# Altium project SVPXGR740_3U.PrjPcb (part 1 of 8)
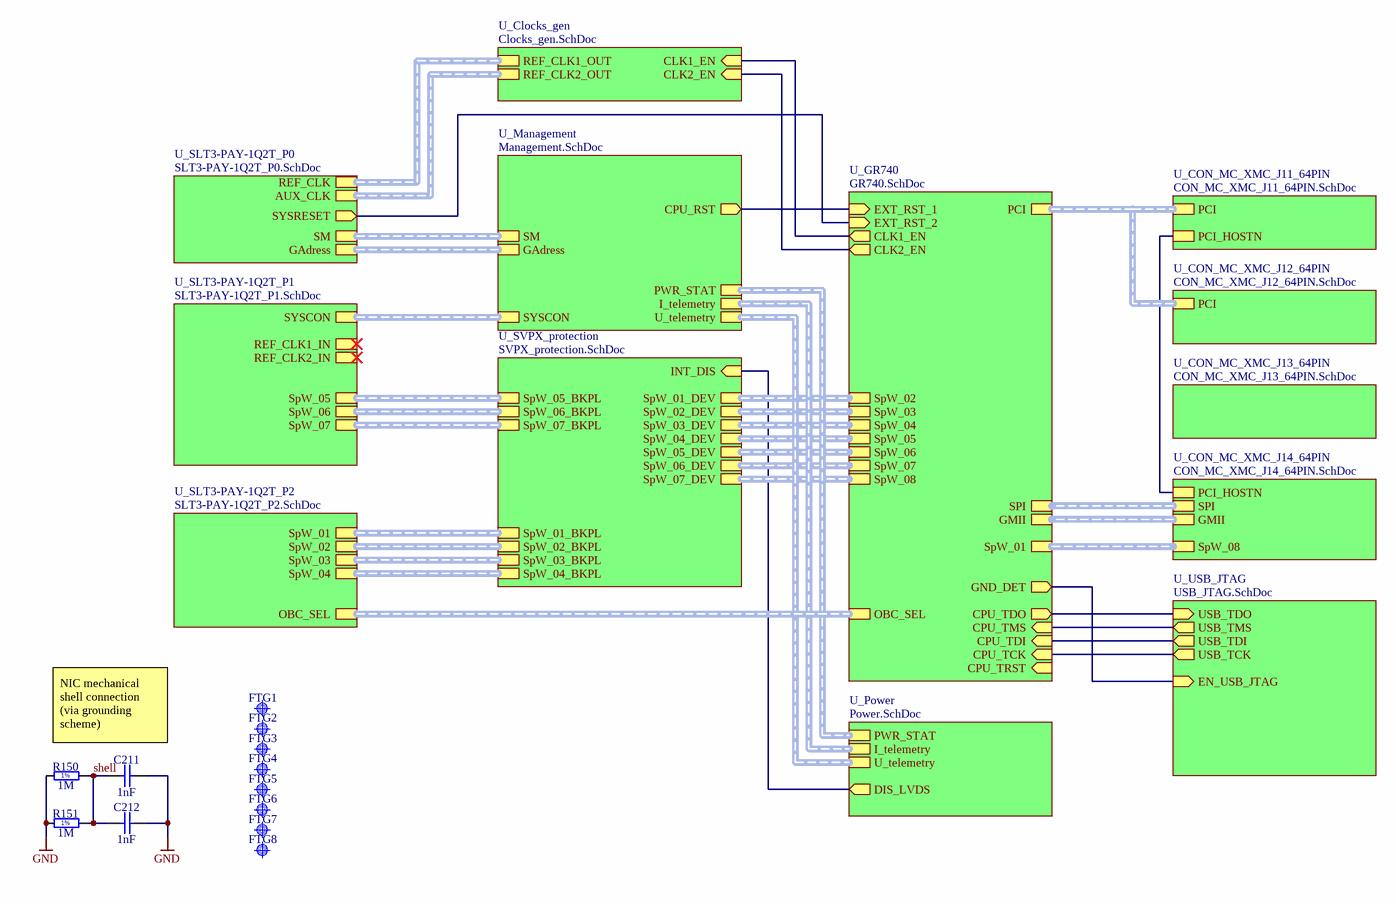
[diagram p0: SVPXGR740_3U.SchDoc]
ProjectAddress1: IBP Shanghai; ProjectAddress2: Level 3 - Building 3; ProjectAddress3: No.168 Linhong Road; ProjectAddress4: Shanghai 200335, China; ProjectOrganization: Altium; ProjectTitle: VPX 6U; Template Family: VPX; Template Notes: - Nominal values used, all dimensions are mm.  - Stackup is not specified in AV46DOT0.PDF, nor implemented in this template.  - The component height constraint is defined in AV46DOT0.pdf, page 90.; Template Revision Date: May 2011; Template Source Document: AV46DOT0.pdf; Template Source Name: ANSI/VITA 46.0-2007; Template Source Organization: VITA; Template Source Revision Date: Oct-2007; Template Source URL: www.vita.com
24 sheets, 790 parts. Net scope: hierarchical (ports join the sheet entries above them; power ports are global).
Board file: SVPXGR740_3U.PcbDoc
Sheets:
  SVPXGR740_3U.SchDoc
    U_SLT3-PAY-1Q2T_P0 = SLT3-PAY-1Q2T_P0.SchDoc
    U_SLT3-PAY-1Q2T_P1 = SLT3-PAY-1Q2T_P1.SchDoc
    U_SLT3-PAY-1Q2T_P2 = SLT3-PAY-1Q2T_P2.SchDoc
    U_SVPX_protection = SVPX_protection.SchDoc
      SpW_01_prot = SpW_protection.SchDoc
      SpW_02_prot = SpW_protection.SchDoc
      SpW_03_prot = SpW_protection.SchDoc
      SpW_04_prot = SpW_protection.SchDoc
      SpW_05_prot = SpW_protection.SchDoc
      SpW_06_prot = SpW_protection.SchDoc
      SpW_07_prot = SpW_protection.SchDoc
    U_GR740 = GR740.SchDoc
      U_GR740_GPIO = GR740_GPIO.SchDoc
      U_GR740_Memory = GR740_Memory.SchDoc
      U_GR740_Power = GR740_Power.SchDoc
      U_GR740_SpW = GR740_SpW.SchDoc
      U_SDRAM = SDRAM.SchDoc
      U_Clocks = Clocks.SchDoc
      U_Flash = Flash.SchDoc
    U_CON_MC_XMC_J11_64PIN = CON_MC_XMC_J11_64PIN.SchDoc
    U_CON_MC_XMC_J12_64PIN = CON_MC_XMC_J12_64PIN.SchDoc
    U_CON_MC_XMC_J13_64PIN = CON_MC_XMC_J13_64PIN.SchDoc
    U_CON_MC_XMC_J14_64PIN = CON_MC_XMC_J14_64PIN.SchDoc
    U_Power = Power.SchDoc
      U_PWR_3V3 = PWR_3V3.SchDoc
    U_USB_JTAG = USB_JTAG.SchDoc
    U_Management = Management.SchDoc
      U_NIC_MSP430_power_jtag = MSP430_power_jtag.SchDoc
    U_Clocks_gen = Clocks_gen.SchDoc

## Sheet SVPXGR740_3U.SchDoc: SVPXFMC Carrier 3U
size 420 x 297 mm; CheckedBy: \; Author: G.Kasprowicz; CompanyName: ISE; DrawnBy: T.Przywozki; Organization: WUT ISE; Address1: Warsaw University of Technology; Address2: Nowowiejska 15/19 00-665 Warsaw; Revision: 1.0.; SheetNumber: 1; SheetTotal: 20; ModifiedBy: -; CheckedDate: -; Title2: Top; DivGrp: ISE; Designer: G.Kasprowicz; Project: SVPXFMC Carrier 3U; ModifiedDate: -; ProjectName: FMC SFP 4

### Parts
C211  1nF  [CAPC1005X55N]
C212  1nF  [CAPC1005X55N]
FTG1  Use only in PCB  [FIDUCIAL_TOP_C100-200]  (value not drawn)
FTG2  Use only in PCB  [FIDUCIAL_TOP_C100-200]  (value not drawn)
FTG3  Use only in PCB  [FIDUCIAL_TOP_C100-200]  (value not drawn)
FTG4  Use only in PCB  [FIDUCIAL_TOP_C100-200]  (value not drawn)
FTG5  Use only in PCB  [FIDUCIAL_TOP_C100-200]  (value not drawn)
FTG6  Use only in PCB  [FIDUCIAL_TOP_C100-200]  (value not drawn)
FTG7  Use only in PCB  [FIDUCIAL_TOP_C100-200]  (value not drawn)
FTG8  Use only in PCB  [FIDUCIAL_TOP_C100-200]  (value not drawn)
R150  1M  [RESC1005X40N]
R151  1M  [RESC1005X40N]

### Sub-sheets
U_Clocks_gen = Clocks_gen.SchDoc: REF_CLK1_OUT (harness CLK), REF_CLK2_OUT (harness CLK), CLK1_EN (in), CLK2_EN (in)
U_CON_MC_XMC_J11_64PIN = CON_MC_XMC_J11_64PIN.SchDoc: PCI (harness PCI), PCI_HOSTN
U_CON_MC_XMC_J12_64PIN = CON_MC_XMC_J12_64PIN.SchDoc: PCI (harness PCI)
U_CON_MC_XMC_J13_64PIN = CON_MC_XMC_J13_64PIN.SchDoc: no entries
U_CON_MC_XMC_J14_64PIN = CON_MC_XMC_J14_64PIN.SchDoc: PCI_HOSTN, SPI (harness SPI), GMII (harness GMII), SpW_08 (harness SpW)
U_GR740 = GR740.SchDoc: EXT_RST_1 (in), PCI (harness PCI), SPI (harness SPI), GMII (harness GMII), SpW_06 (harness SpW), SpW_05 (harness SpW), SpW_04 (harness SpW), SpW_03 (harness SpW), SpW_01 (harness SpW), SpW_07 (harness SpW), SpW_08 (harness SpW), SpW_02 (harness SpW), CPU_TDO (out), CPU_TMS (in), CPU_TDI (in), CPU_TCK (in), CPU_TRST (in), OBC_SEL (harness OBC_SEL), EXT_RST_2 (in), CLK1_EN (out), CLK2_EN (out), GND_DET (out)
U_Management = Management.SchDoc: SM (harness SM), GAdress (harness GAdress), U_telemetry (harness Umeas), I_telemetry (harness Imeas), PWR_STAT (harness PWR_STAT), SYSCON (harness SYSCON), CPU_RST (out)
U_Power = Power.SchDoc: I_telemetry (harness Imeas), U_telemetry (harness Umeas), PWR_STAT (harness PWR_STAT), DIS_LVDS (out)
U_SLT3-PAY-1Q2T_P0 = SLT3-PAY-1Q2T_P0.SchDoc: AUX_CLK (harness CLK), REF_CLK (harness CLK), GAdress (harness GAdress), SM (harness SM), SYSRESET (out)
U_SLT3-PAY-1Q2T_P1 = SLT3-PAY-1Q2T_P1.SchDoc: SYSCON (harness SYSCON), REF_CLK2_IN (harness CLK), REF_CLK1_IN (harness CLK), SpW_05 (harness SpW), SpW_06 (harness SpW), SpW_07 (harness SpW)
U_SLT3-PAY-1Q2T_P2 = SLT3-PAY-1Q2T_P2.SchDoc: SpW_02 (harness SpW), OBC_SEL (harness OBC_SEL), SpW_04 (harness SpW), SpW_03 (harness SpW), SpW_01 (harness SpW)
U_SVPX_protection = SVPX_protection.SchDoc: INT_DIS (in), SpW_01_BKPL (harness SpW), SpW_01_DEV (harness SpW), SpW_02_BKPL (harness SpW), SpW_03_BKPL (harness SpW), SpW_04_BKPL (harness SpW), SpW_05_BKPL (harness SpW), SpW_02_DEV (harness SpW), SpW_05_DEV (harness SpW), SpW_06_BKPL (harness SpW), SpW_07_BKPL (harness SpW), SpW_06_DEV (harness SpW), SpW_07_DEV (harness SpW), SpW_03_DEV (harness SpW), SpW_04_DEV (harness SpW)
U_USB_JTAG = USB_JTAG.SchDoc: USB_TDO (in), USB_TMS (out), USB_TDI (out), USB_TCK (out), EN_USB_JTAG (in)

### Nets
GND: C211.2 C212.2 R150.1 R151.1
CLK1_EN: sheet U_GR740/CLK1_EN, sheet U_Clocks_gen/CLK1_EN
CLK2_EN: sheet U_GR740/CLK2_EN, sheet U_Clocks_gen/CLK2_EN
CPU_RST: sheet U_GR740/EXT_RST_1, sheet U_Management/CPU_RST
CPU_TCK: sheet U_GR740/CPU_TCK, sheet U_USB_JTAG/USB_TCK
CPU_TDI: sheet U_GR740/CPU_TDI, sheet U_USB_JTAG/USB_TDI
CPU_TDO: sheet U_GR740/CPU_TDO, sheet U_USB_JTAG/USB_TDO
CPU_TMS: sheet U_GR740/CPU_TMS, sheet U_USB_JTAG/USB_TMS
DIS_LVDS: sheet U_SVPX_protection/INT_DIS, sheet U_Power/DIS_LVDS
GND_DET: sheet U_GR740/GND_DET, sheet U_USB_JTAG/EN_USB_JTAG
PCI_HOSTN: sheet U_CON_MC_XMC_J11_64PIN/PCI_HOSTN, sheet U_CON_MC_XMC_J14_64PIN/PCI_HOSTN
shell: C211.1 C212.1 R150.2 R151.2  [project net shell_1]
SYSRESET*: sheet U_SLT3-PAY-1Q2T_P0/SYSRESET, sheet U_GR740/EXT_RST_2

### Buses and harness runs
harness sheet U_Clocks_gen/REF_CLK1_OUT = sheet U_SLT3-PAY-1Q2T_P0/REF_CLK
harness sheet U_Clocks_gen/REF_CLK2_OUT = sheet U_SLT3-PAY-1Q2T_P0/AUX_CLK
harness sheet U_CON_MC_XMC_J11_64PIN/PCI = sheet U_CON_MC_XMC_J12_64PIN/PCI = sheet U_GR740/PCI
harness sheet U_CON_MC_XMC_J14_64PIN/GMII = sheet U_GR740/GMII
harness sheet U_CON_MC_XMC_J14_64PIN/SPI = sheet U_GR740/SPI
harness sheet U_CON_MC_XMC_J14_64PIN/SpW_08 = sheet U_GR740/SpW_01
harness sheet U_GR740/OBC_SEL = sheet U_SLT3-PAY-1Q2T_P2/OBC_SEL
harness sheet U_GR740/SpW_02 = sheet U_SVPX_protection/SpW_01_DEV
harness sheet U_GR740/SpW_03 = sheet U_SVPX_protection/SpW_02_DEV
harness sheet U_GR740/SpW_04 = sheet U_SVPX_protection/SpW_03_DEV
harness sheet U_GR740/SpW_05 = sheet U_SVPX_protection/SpW_04_DEV
harness sheet U_GR740/SpW_06 = sheet U_SVPX_protection/SpW_05_DEV
harness sheet U_GR740/SpW_07 = sheet U_SVPX_protection/SpW_06_DEV
harness sheet U_GR740/SpW_08 = sheet U_SVPX_protection/SpW_07_DEV
harness sheet U_Management/GAdress = sheet U_SLT3-PAY-1Q2T_P0/GAdress
harness sheet U_Management/I_telemetry = sheet U_Power/I_telemetry
harness sheet U_Management/PWR_STAT = sheet U_Power/PWR_STAT
harness sheet U_Management/SM = sheet U_SLT3-PAY-1Q2T_P0/SM
harness sheet U_Management/SYSCON = sheet U_SLT3-PAY-1Q2T_P1/SYSCON
harness sheet U_Management/U_telemetry = sheet U_Power/U_telemetry
harness sheet U_SLT3-PAY-1Q2T_P1/SpW_05 = sheet U_SVPX_protection/SpW_05_BKPL
harness sheet U_SLT3-PAY-1Q2T_P1/SpW_06 = sheet U_SVPX_protection/SpW_06_BKPL
harness sheet U_SLT3-PAY-1Q2T_P1/SpW_07 = sheet U_SVPX_protection/SpW_07_BKPL
harness sheet U_SLT3-PAY-1Q2T_P2/SpW_01 = sheet U_SVPX_protection/SpW_01_BKPL
harness sheet U_SLT3-PAY-1Q2T_P2/SpW_02 = sheet U_SVPX_protection/SpW_02_BKPL
harness sheet U_SLT3-PAY-1Q2T_P2/SpW_03 = sheet U_SVPX_protection/SpW_03_BKPL
harness sheet U_SLT3-PAY-1Q2T_P2/SpW_04 = sheet U_SVPX_protection/SpW_04_BKPL

### Notes on the sheet
- NIC mechanical shell connection (via grounding scheme)
- Project/Equipment
- Document
- Designer
- Drawn by
- Check.by
- File
- Last Mod.
- Print Date
- Sheet
- Size
- A3
- of
- Rev
- Copyright WUT ISE 2019
  This documentation describes Open Hardware and is licensed under the CERN OHL v.1.1. You may redistribute and modify this documentation under the terms of the CERN OHL v1.1.
  (http://ohwr.org/CERNOHL). This documentation is dristributed WITHOUT ANY EXPRESS OR IMPLIED WARRANTY, INCLUDING OF MERCHANTABILITY, SATISFACTORY QUALITY AND FITNESS FOR A PARTICULAR PURPOSE. Please see the CERN OHL v.1.1 for applicable conditions
- (in symbol R0402_1M_1%_0.0625W_100PPM) 1%

### Library data of the parts
C211 C212 = CC0402_1NF_50V_10%_X7R: Non-polarised capacitor; Part Description: SMD Multilayer Chip Ceramic Capacitor; Manufacturer: GENERIC; Manufacturer1 Part Number: 223858715623; Voltage: 50V; TC: X7R; Tolerance: ±10%; Part Number: CC0402_1NF_50V_10%_X7R; Component Kind: Standard; Component Type: Standard; Pin Count: 2; Value: 1nF; Status: Not Recommended; Manufacturer Part Number: CC0402_1NF_50V_10%_X7R; Case: 0402; Mounted: Yes; Socket: No; SMD: Yes; Sense: No; Manufacturer1 Example: PHYCOMP; Manufacturer1 ComponentHeight: 0.55mm; HelpURL: \\cern.ch\dfs\Applications\Altium\Datasheets\CC0402_X7R_PHYCOMP.pdf; Author: CERN DEM JLC; CreateDate: 03.12.2007; LatestRevisionDate: 03.12.2007
FTG1-FTG8 = FIDUCIAL_TARGET_C100-200: Fiducial Target; Part Description: Round Fiducial Target, Top Layer, 1.0mm, Top Solder 2.0mm, Keepout =2.0mm; Mounted: No; Part Number: FIDUCIAL_TARGET_C100-200; Component Kind: Standard (No BOM); Component Type: Standard (No BOM); Pin Count: 1; Family: Fiducial; Socket: No; SMD: Yes; Sense: No; Status: None; ComponentHeight: 0mm; HelpURL: Undefined; Author: CERN DEM JLC; CreateDate: 09.02.2010; LatestRevisionDate: 04.04.2012; PackageDescription: Round Fiducial Target, Top Layer, 1.0mm, Top Solder 2.0mm, Keepout =2.0mm
R150 R151 = R0402_1M_1%_0.0625W_100PPM: Resistor - 1%; Part Description: General Purpose Thick Film Chip Resistor; Manufacturer: GENERIC; Manufacturer1 Part Number: 232270671005L; TC: ±100ppm/°C; PressFit: No; Part Number: R0402_1M_1%_0.0625W_100PPM; Component Kind: Standard; Component Type: Standard; Pin Count: 2; Value: 1M; Status: Not Recommended; Power: 0.0625W; Tolerance: ±1%; Manufacturer Part Number: R0402_1M_1%_0.0625W_100PPM; Case: 0402; Mounted: Yes; Sense: No; Socket: No; SMD: Yes; Manufacturer1 Example: YAGEO PHYCOMP; Manufacturer1 ComponentHeight: 0.4mm; HelpURL: \\cern.ch\dfs\Applications\Altium\Datasheets\R0402_Phycomp_RC0402.pdf; Author: CERN DEM JLC; CreateDate: 03.12.2007; LatestRevisionDate: 17.10.2012

## Sheet SLT3-PAY-1Q2T_P0.SchDoc: SVPXFMC Carrier 3U
size A4; CheckedBy: \; Author: G.Kasprowicz; CompanyName: ISE; DrawnBy: T.Przywozki; Organization: WUT ISE; Address1: Warsaw University of Technology; Address2: Nowowiejska 15/19 00-665 Warsaw; Revision: 1.0.; SheetNumber: 14; SheetTotal: 20; Project: SVPXFMC Carrier 3U; ModifiedBy: -; CheckedDate: -; Title2: SpaceVPX P0, SLT3-PAY-1Q2T; DivGrp: ISE; Designer: G. Kasprowicz
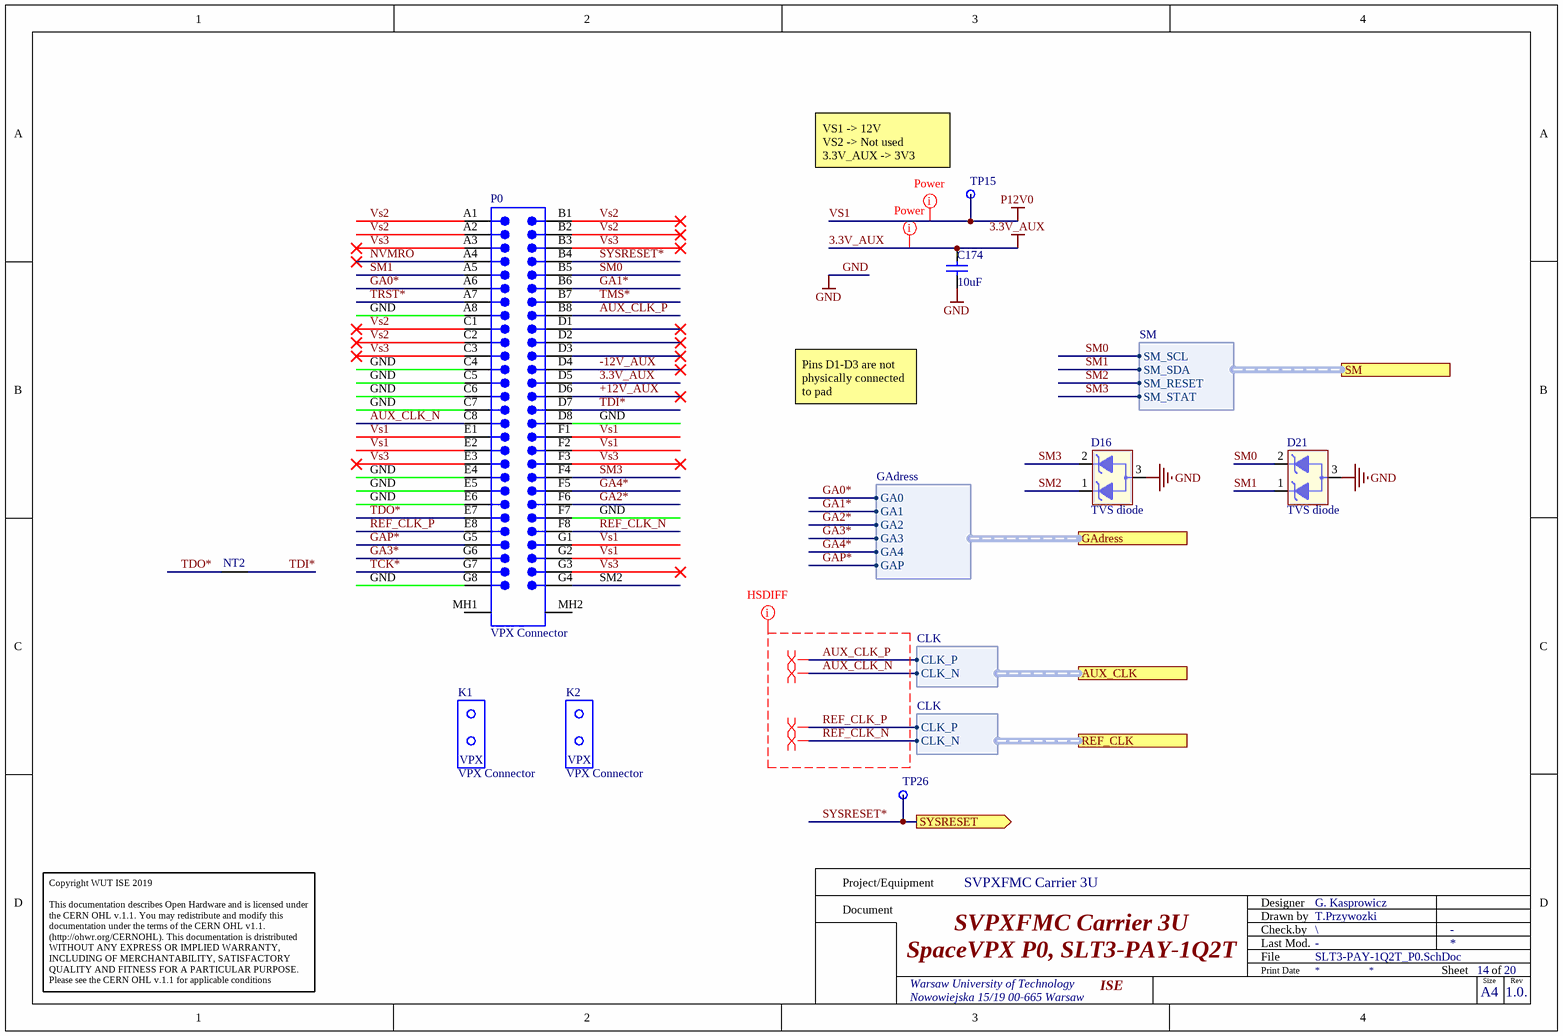
[diagram p1: SLT3-PAY-1Q2T_P0.SchDoc]

### Parts
C174  10uF  [CAPC2012X135N]
D16  TVS diode  [SOT-723_(ESD7C3.3DT5G)]
D21  TVS diode  [SOT-723_(ESD7C3.3DT5G)]
K1  VPX Connector  [BTB5-5-2H2F]
K2  VPX Connector  [BTB5-5-2H2F]
NT2  Net Tie  [Net Tie]  (value not drawn)  (net tie, no BOM)
P0  VPX Connector  [BTB1-8-2H56M]
TP15  Test Point  [TPS127]  (value not drawn)
TP26  Test Point  [TPS127]  (value not drawn)

### Ports
AUX_CLK (harness CLK), GAdress (harness GAdress), REF_CLK (harness CLK), SM (harness SM), SYSRESET (out)

### Harnesses
SM: SM_SCL, SM_SDA, SM_RESET, SM_STAT
GAdress: GA0, GA1, GA2, GA3, GA4, GAP
CLK: CLK_P, CLK_N

### Nets
3.3V_AUX: C174.2 P0.D5
GND: C174.1 D16.3 D21.3 P0.A8 P0.C4 P0.C5 P0.C6 P0.C7 P0.D8 P0.E4 P0.E5 P0.E6 P0.F7 P0.G8
VS1: P0.E1 P0.E2 P0.F1 P0.F2 P0.G1 P0.G2 TP15.1  [also labelled P12V0]
+12V_AUX: P0.D6  [project net +12V_AUX_14]
-12V_AUX: P0.D4  [project net -12V_AUX_14]
AUX_CLK_N: P0.C8 ; port AUX_CLK.CLK_N
AUX_CLK_P: P0.B8 ; port AUX_CLK.CLK_P
GA0*: P0.A6 ; port GAdress.GA0  [project net GA0]
GA1*: P0.B6 ; port GAdress.GA1  [project net GA1]
GA2*: P0.F6 ; port GAdress.GA2  [project net GA2]
GA3*: P0.G6 ; port GAdress.GA3  [project net GA3]
GA4*: P0.F5 ; port GAdress.GA4  [project net GA4]
GAP*: P0.G5 ; port GAdress.GAP  [project net GAP]
NVMRO: P0.A4  [project net NVMRO_14]
REF_CLK_N: P0.F8 ; port REF_CLK.CLK_N
REF_CLK_P: P0.E8 ; port REF_CLK.CLK_P
SM0: D21.2 P0.B5 ; port SM.SM_SCL
SM1: D21.1 P0.A5 ; port SM.SM_SDA
SM2: D16.1 P0.G4 ; port SM.SM_RESET
SM3: D16.2 P0.F4 ; port SM.SM_STAT
SYSRESET*: P0.B4 TP26.1 ; port SYSRESET
TCK*: P0.G7  [project net TCK*_14]
TDI*: NT2.2 P0.D7  [project net TDI*_14]
TDO*: NT2.1 P0.E7  [project net TDO*_14]
TMS*: P0.B7  [project net TMS*_14]
TRST*: P0.A7  [project net TRST*_14]
Vs2: P0.A1 P0.A2 P0.B1 P0.B2 P0.C1 P0.C2  [project net Vs2_14]
Vs3: P0.A3 P0.B3 P0.C3 P0.E3 P0.F3 P0.G3  [project net Vs3_14]

Not connected (* = marked no-connect by the designer): P0 D1* D2* D3* MH1 MH2

### Layout directives
differential pair: AUX_CLK_N, AUX_CLK_P, REF_CLK_N, REF_CLK_P
net class HSDIFF: AUX_CLK_N, AUX_CLK_P, REF_CLK_N, REF_CLK_P
net class Power: 3.3V_AUX, VS1

### Notes on the sheet
- (near TP15) VS1 -> 12V
  VS2 -> Not used
  3.3V_AUX -> 3V3
- Pins D1-D3 are not physically connected to pad
- Project/Equipment
- Document
- Designer
- Drawn by
- Check.by
- Copyright WUT ISE 2019
  This documentation describes Open Hardware and is licensed under the CERN OHL v.1.1. You may redistribute and modify this documentation under the terms of the CERN OHL v1.1.
  (http://ohwr.org/CERNOHL). This documentation is dristributed WITHOUT ANY EXPRESS OR IMPLIED WARRANTY, INCLUDING OF MERCHANTABILITY, SATISFACTORY QUALITY AND FITNESS FOR A PARTICULAR PURPOSE. Please see the CERN OHL v.1.1 for applicable conditions
- File
- Last Mod.
- Print Date
- Sheet
- Size
- A4
- of
- Rev
- (in symbol 2000713-6) VPX

### Library data of the parts
C174 = CC0805_10UF_16V_10%_X5R: Non-polarised capacitor; Part Description: SMD Multilayer Chip Ceramic Capacitor; Manufacturer: GENERIC; Manufacturer1 Part Number: C0805C106K4PAC; Voltage: 16V; TC: X5R; Tolerance: ±10%; Part Number: CC0805_10UF_16V_10%_X5R; Component Kind: Standard; Component Type: Standard; Pin Count: 2; Value: 10uF; Status: Preferred; Manufacturer Part Number: CC0805_10UF_16V_10%_X5R; Case: 0805; Mounted: Yes; Socket: No; SMD: Yes; Sense: No; Manufacturer1 Example: KEMET; Manufacturer1 ComponentHeight: 1.4mm; HelpURL: \\cern.ch\dfs\Applications\Altium\Datasheets\CC1206_X5R_KEMET.pdf; Author: CERN DEM JLC; CreateDate: 03/12/2007; LatestRevisionDate: 03/12/2007
D16 D21 = ESD7C3.3DT5G: Dual TVS diode, Vrwm=3.3V; Manufacturer: ON Semiconductor; Bonding: No; ComponentHeigth: 0.5mm; PressFit: No; Value: 3.3V; Case: SOT-723; Component Kind: Standard; Component Type: Standard; CreateDate: 2018-06-18; Device: TVS diode; HelpURL: https://www.onsemi.com/pub/Collateral/ESD7C3.3D-D.PDF; LatestRevisionDate: 2018-06-18; Manufacturer Part Number: ESD7C3.3DT5G; Mounted: Yes; PackageDescription: SOT-723; Part Description: TVS diode; Part Number: ESD7C3.3DT5G; Pin Count: 3; Sense: No; SMD: Yes; Socket: No
K1 K2 = 2000713-6: VPX VITA 46 Alignment key Ruggedized, Right Angle, 1Key, Key orientation 0; Manufacturer: TE; Bonding: No; ComponentHeigth: 9.7mm; PressFit: No; Case: *; Component Kind: Standard; Component Type: Standard; CreateDate: 2018-01-01; Device: 2000713-6; Footprint: 2000713-6; HelpURL: *; LatestRevisionDate: 2018-01-01; Manufacturer Part Number: 2000713-6; Mounted: Yes; PackageDescription: *; Part Description: VPX VITA 46 Alignment key Ruggedized, Right Angle, 1Key, Key orientation 0; Part Number: 2000713-6; Pin Count: *; Sense: No; SMD: Yes; Socket: No; Family: VPX Connector
NT2 = Net Tie: Part Description: Net Tie (2 Nets); Mounted: No; Part Number: Net Tie; Component Type: Net Tie; Pin Count: 2; Family: Net Tie; Socket: No; SMD: No; Sense: No; Status: None; ComponentHeight: 0mm; HelpURL: Undefined; Author: CERN DEM JLC; CreateDate: 22.03.2011; LatestRevisionDate: 22.03.2011; PackageDescription: 2 Plated Through Hole For Coaxial Cable Link: Hole Dia.=1.4mm Pad Dia.=2.5mm
P0 = 2102772-1: Ruggedized Board-to-Board Connector, Right Angle, 7-Row, Pitch 1.8mm, 56-Position; Manufacturer: TE; Bonding: No; ComponentHeigth: 14.7mm; PressFit: No; Case: *; Component Kind: Standard; Component Type: Standard; CreateDate: 2018-01-01; Device: 2102772-1; Footprint: 2102772-1; HelpURL: *; LatestRevisionDate: 2018-01-01; Manufacturer Part Number: 2102772-1; Mounted: Yes; PackageDescription: *; Part Description: Ruggedized Board-to-Board Connector, Right Angle, 7-Row, Pitch 1.8mm, 56-Position; Part Number: 2102772-1; Pin Count: *; Sense: No; SMD: Yes; Socket: No; Family: VPX Connector
TP15 TP26 = SMD_PAD_1.27X1.27MM: Part Description: 1.27mm x 1.27mm PCB Copper Area (SMD Test Point); Mounted: No; Part Number: SMD_PAD_1.27X1.27MM; Component Kind: Standard (No BOM); Component Type: Standard (No BOM); Pin Count: 1; Family: Test Point; Socket: No; SMD: Yes; Sense: No; Status: None; ComponentHeight: 0mm; HelpURL: Undefined; Author: CERN DEM JLC; CreateDate: 12.01.2008; LatestRevisionDate: 12.01.2008; PackageDescription: 1.27mm x 1.27mm PCB Copper Area (SMD Test Point)

## Sheet SLT3-PAY-1Q2T_P1.SchDoc: SVPXFMC Carrier 3U
size A3; CheckedBy: \; Author: G.Kasprowicz; CompanyName: ISE; DrawnBy: T.Przywozki; Organization: WUT ISE; Address1: Warsaw University of Technology; Address2: Nowowiejska 15/19 00-665 Warsaw; Revision: 1.0.; SheetNumber: 13; SheetTotal: 20; Project: SVPXFMC Carrier 3U; ModifiedBy: -; CheckedDate: -; Title2: SpaceVPX P1, SLT3-PAY-1Q2T; DivGrp: ISE; Designer: G. Kasprowicz
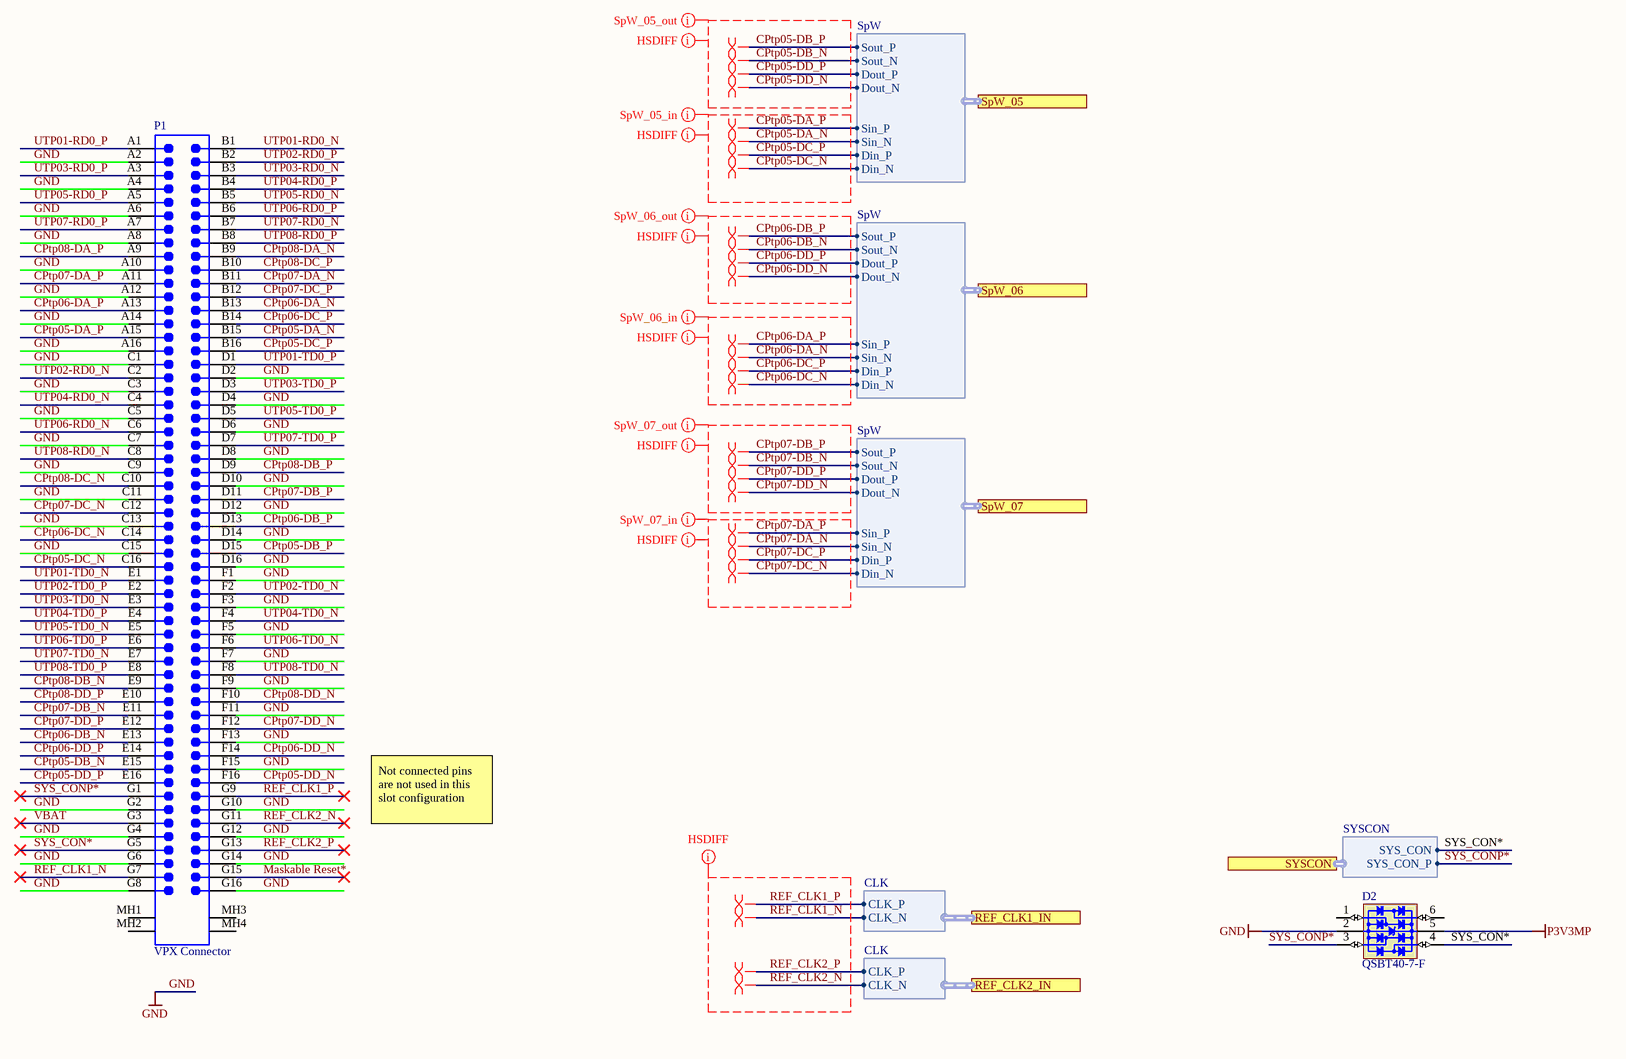
[diagram p2: SLT3-PAY-1Q2T_P1.SchDoc]

### Parts
D2  QSBT40-7-F  [SOT65P210X110-6N]
P1  VPX Connector  [BTB1-8-4H112M]

### Ports
REF_CLK1_IN (harness CLK), REF_CLK2_IN (harness CLK), SpW_05 (harness SpW), SpW_06 (harness SpW), SpW_07 (harness SpW), SYSCON (harness SYSCON)

### Harnesses
SpW: Sout_P, Sout_N, Dout_P, Dout_N, Sin_P, Sin_N, Din_P, Din_N
CLK: CLK_P, CLK_N
SYSCON: SYS_CON, SYS_CON_P

### Nets
GND: D2.2(GND) P1.A2 P1.A4 P1.A6 P1.A8 P1.A10 P1.A12 P1.A14 P1.A16 P1.C1 P1.C3 P1.C5 P1.C7 P1.C9 P1.C11 P1.C13 P1.C15 P1.D2 P1.D4 P1.D6 P1.D8 P1.D10 P1.D12 P1.D14 P1.D16 P1.F1 P1.F3 P1.F5 P1.F7 P1.F9 P1.F11 P1.F13 P1.F15 P1.G2 P1.G4 P1.G6 P1.G8 P1.G10 P1.G12 P1.G14 P1.G16
P3V3MP: D2.5(VBUS)
CPtp05-DA_N: P1.B15 ; port SpW_05.Sin_N
CPtp05-DA_P: P1.A15 ; port SpW_05.Sin_P
CPtp05-DB_N: P1.E15 ; port SpW_05.Sout_N
CPtp05-DB_P: P1.D15 ; port SpW_05.Sout_P
CPtp05-DC_N: P1.C16 ; port SpW_05.Din_N
CPtp05-DC_P: P1.B16 ; port SpW_05.Din_P
CPtp05-DD_N: P1.F16 ; port SpW_05.Dout_N
CPtp05-DD_P: P1.E16 ; port SpW_05.Dout_P
CPtp06-DA_N: P1.B13 ; port SpW_06.Sin_N
CPtp06-DA_P: P1.A13 ; port SpW_06.Sin_P
CPtp06-DB_N: P1.E13 ; port SpW_06.Sout_N
CPtp06-DB_P: P1.D13 ; port SpW_06.Sout_P
CPtp06-DC_N: P1.C14 ; port SpW_06.Din_N
CPtp06-DC_P: P1.B14 ; port SpW_06.Din_P
CPtp06-DD_N: P1.F14 ; port SpW_06.Dout_N
CPtp06-DD_P: P1.E14 ; port SpW_06.Dout_P
CPtp07-DA_N: P1.B11 ; port SpW_07.Sin_N
CPtp07-DA_P: P1.A11 ; port SpW_07.Sin_P
CPtp07-DB_N: P1.E11 ; port SpW_07.Sout_N
CPtp07-DB_P: P1.D11 ; port SpW_07.Sout_P
CPtp07-DC_N: P1.C12 ; port SpW_07.Din_N
CPtp07-DC_P: P1.B12 ; port SpW_07.Din_P
CPtp07-DD_N: P1.F12 ; port SpW_07.Dout_N
CPtp07-DD_P: P1.E12 ; port SpW_07.Dout_P
CPtp08-DA_N: P1.B9  [project net CPtp08-DA_N_13]
CPtp08-DA_P: P1.A9  [project net CPtp08-DA_P_13]
CPtp08-DB_N: P1.E9  [project net CPtp08-DB_N_13]
CPtp08-DB_P: P1.D9  [project net CPtp08-DB_P_13]
CPtp08-DC_N: P1.C10  [project net CPtp08-DC_N_13]
CPtp08-DC_P: P1.B10  [project net CPtp08-DC_P_13]
CPtp08-DD_N: P1.F10  [project net CPtp08-DD_N_13]
CPtp08-DD_P: P1.E10  [project net CPtp08-DD_P_13]
Maskable Reset*: P1.G15  [project net Maskable Reset*_13]
REF_CLK1_N: P1.G7 ; port REF_CLK1_IN.CLK_N
REF_CLK1_P: P1.G9 ; port REF_CLK1_IN.CLK_P
REF_CLK2_N: P1.G11 ; port REF_CLK2_IN.CLK_N
REF_CLK2_P: P1.G13 ; port REF_CLK2_IN.CLK_P
SYS_CON*: D2.4(I/O3) P1.G5 ; port SYSCON.SYS_CON  [project net SYS_CON]
SYS_CONP*: D2.3(I/O2) P1.G1 ; port SYSCON.SYS_CON_P  [project net SYS_CON_P]
UTP01-RD0_N: P1.B1  [project net UTP01-RD0_N_13]
UTP01-RD0_P: P1.A1  [project net UTP01-RD0_P_13]
UTP01-TD0_N: P1.E1  [project net UTP01-TD0_N_13]
UTP01-TD0_P: P1.D1  [project net UTP01-TD0_P_13]
UTP02-RD0_N: P1.C2  [project net UTP02-RD0_N_13]
UTP02-RD0_P: P1.B2  [project net UTP02-RD0_P_13]
UTP02-TD0_N: P1.F2  [project net UTP02-TD0_N_13]
UTP02-TD0_P: P1.E2  [project net UTP02-TD0_P_13]
UTP03-RD0_N: P1.B3  [project net UTP03-RD0_N_13]
UTP03-RD0_P: P1.A3  [project net UTP03-RD0_P_13]
UTP03-TD0_N: P1.E3  [project net UTP03-TD0_N_13]
UTP03-TD0_P: P1.D3  [project net UTP03-TD0_P_13]
UTP04-RD0_N: P1.C4  [project net UTP04-RD0_N_13]
UTP04-RD0_P: P1.B4  [project net UTP04-RD0_P_13]
UTP04-TD0_N: P1.F4  [project net UTP04-TD0_N_13]
UTP04-TD0_P: P1.E4  [project net UTP04-TD0_P_13]
UTP05-RD0_N: P1.B5  [project net UTP05-RD0_N_13]
UTP05-RD0_P: P1.A5  [project net UTP05-RD0_P_13]
UTP05-TD0_N: P1.E5  [project net UTP05-TD0_N_13]
UTP05-TD0_P: P1.D5  [project net UTP05-TD0_P_13]
UTP06-RD0_N: P1.C6  [project net UTP06-RD0_N_13]
UTP06-RD0_P: P1.B6  [project net UTP06-RD0_P_13]
UTP06-TD0_N: P1.F6  [project net UTP06-TD0_N_13]
UTP06-TD0_P: P1.E6  [project net UTP06-TD0_P_13]
UTP07-RD0_N: P1.B7  [project net UTP07-RD0_N_13]
UTP07-RD0_P: P1.A7  [project net UTP07-RD0_P_13]
UTP07-TD0_N: P1.E7  [project net UTP07-TD0_N_13]
UTP07-TD0_P: P1.D7  [project net UTP07-TD0_P_13]
UTP08-RD0_N: P1.C8  [project net UTP08-RD0_N_13]
UTP08-RD0_P: P1.B8  [project net UTP08-RD0_P_13]
UTP08-TD0_N: P1.F8  [project net UTP08-TD0_N_13]
UTP08-TD0_P: P1.E8  [project net UTP08-TD0_P_13]
VBAT: P1.G3  [project net VBAT_13]

Not connected (* = marked no-connect by the designer): D2 1(I/O1) 6(I/O4); P1 MH1 MH2 MH3 MH4

### Layout directives
differential pair: CPtp05-DA_N, CPtp05-DA_P, CPtp05-DB_N, CPtp05-DB_P, CPtp05-DC_N, CPtp05-DC_P, CPtp05-DD_N, CPtp05-DD_P, CPtp06-DA_N, CPtp06-DA_P, CPtp06-DB_N, CPtp06-DB_P, CPtp06-DC_N, CPtp06-DC_P, CPtp06-DD_N, CPtp06-DD_P, CPtp07-DA_N, CPtp07-DA_P, CPtp07-DB_N, CPtp07-DB_P, CPtp07-DC_N, CPtp07-DC_P, CPtp07-DD_N, CPtp07-DD_P, REF_CLK1_N, REF_CLK1_P, REF_CLK2_N, REF_CLK2_P
net class SpW_05_out: CPtp05-DB_N, CPtp05-DB_P, CPtp05-DD_N, CPtp05-DD_P
net class SpW_05_in: CPtp05-DA_N, CPtp05-DA_P, CPtp05-DC_N, CPtp05-DC_P
net class SpW_06_out: CPtp06-DB_N, CPtp06-DB_P, CPtp06-DD_N, CPtp06-DD_P
net class SpW_06_in: CPtp06-DA_N, CPtp06-DA_P, CPtp06-DC_N, CPtp06-DC_P
net class HSDIFF: CPtp05-DA_N, CPtp05-DA_P, CPtp05-DB_N, CPtp05-DB_P, CPtp05-DC_N, CPtp05-DC_P, CPtp05-DD_N, CPtp05-DD_P, CPtp06-DA_N, CPtp06-DA_P, CPtp06-DB_N, CPtp06-DB_P, CPtp06-DC_N, CPtp06-DC_P, CPtp06-DD_N, CPtp06-DD_P, CPtp07-DA_N, CPtp07-DA_P, CPtp07-DB_N, CPtp07-DB_P, CPtp07-DC_N, CPtp07-DC_P, CPtp07-DD_N, CPtp07-DD_P, REF_CLK1_N, REF_CLK1_P, REF_CLK2_N, REF_CLK2_P
net class SpW_07_out: CPtp07-DB_N, CPtp07-DB_P, CPtp07-DD_N, CPtp07-DD_P
net class SpW_07_in: CPtp07-DA_N, CPtp07-DA_P, CPtp07-DC_N, CPtp07-DC_P

### Notes on the sheet
- Not connected pins are not used in this slot configuration
- Title
- Size:
- Date:
- A3
- Number:
- Time:
- Revision:
- Sheet
- of
- File:

### Library data of the parts
D2 = D_TVS_QSBT40-7-F: Bonding: No; PressFit: No; Case: *; Component Kind: Standard; Component Type: Standard; ComponentHeigth: *; CreateDate: 2018-01-01; Device: QSBT40-7-F; Footprint: SOT363; HelpURL: *; LatestRevisionDate: 2018-01-01; Manufacturer: *; Manufacturer Part Number: QSBT40-7-F; Mounted: Yes; PackageDescription: *; Part Description: *; Part Number: *; Pin Count: 6; Sense: No; SMD: Yes; Socket: No; Value: *
P1 = 2102771-1: Ruggedized Board-to-Board Connector, Right Angle, 7-Row, Pitch 1.8mm, 112-Position; Manufacturer: TE; Bonding: No; ComponentHeigth: 14.7mm; PressFit: No; Case: *; Component Kind: Standard; Component Type: Standard; CreateDate: 2018-01-01; Device: *; Footprint: *; HelpURL: *; LatestRevisionDate: 2018-01-01; Manufacturer Part Number: 2102771-1; Mounted: Yes; PackageDescription: 2102771-1; Part Description: Ruggedized Board-to-Board Connector, Right Angle, 7-Row, Pitch 1.8mm, 112-Position; Part Number: 2102771-1; Pin Count: *; Sense: No; SMD: Yes; Socket: No; Family: VPX Connector

## Sheet SLT3-PAY-1Q2T_P2.SchDoc: SVPXFMC Carrier 3U
size A3; CheckedBy: \; Author: G.Kasprowicz; CompanyName: ISE; DrawnBy: T.Przywozki; Organization: WUT ISE; Address1: Warsaw University of Technology; Address2: Nowowiejska 15/19 00-665 Warsaw; Revision: 1.0.; SheetNumber: 12; SheetTotal: 20; Project: SVPXFMC Carrier 3U; ModifiedBy: -; CheckedDate: -; Title2: SpaceVPX P2, SLT3-PAY-1Q2T; DivGrp: ISE; Designer: G. Kasprowicz
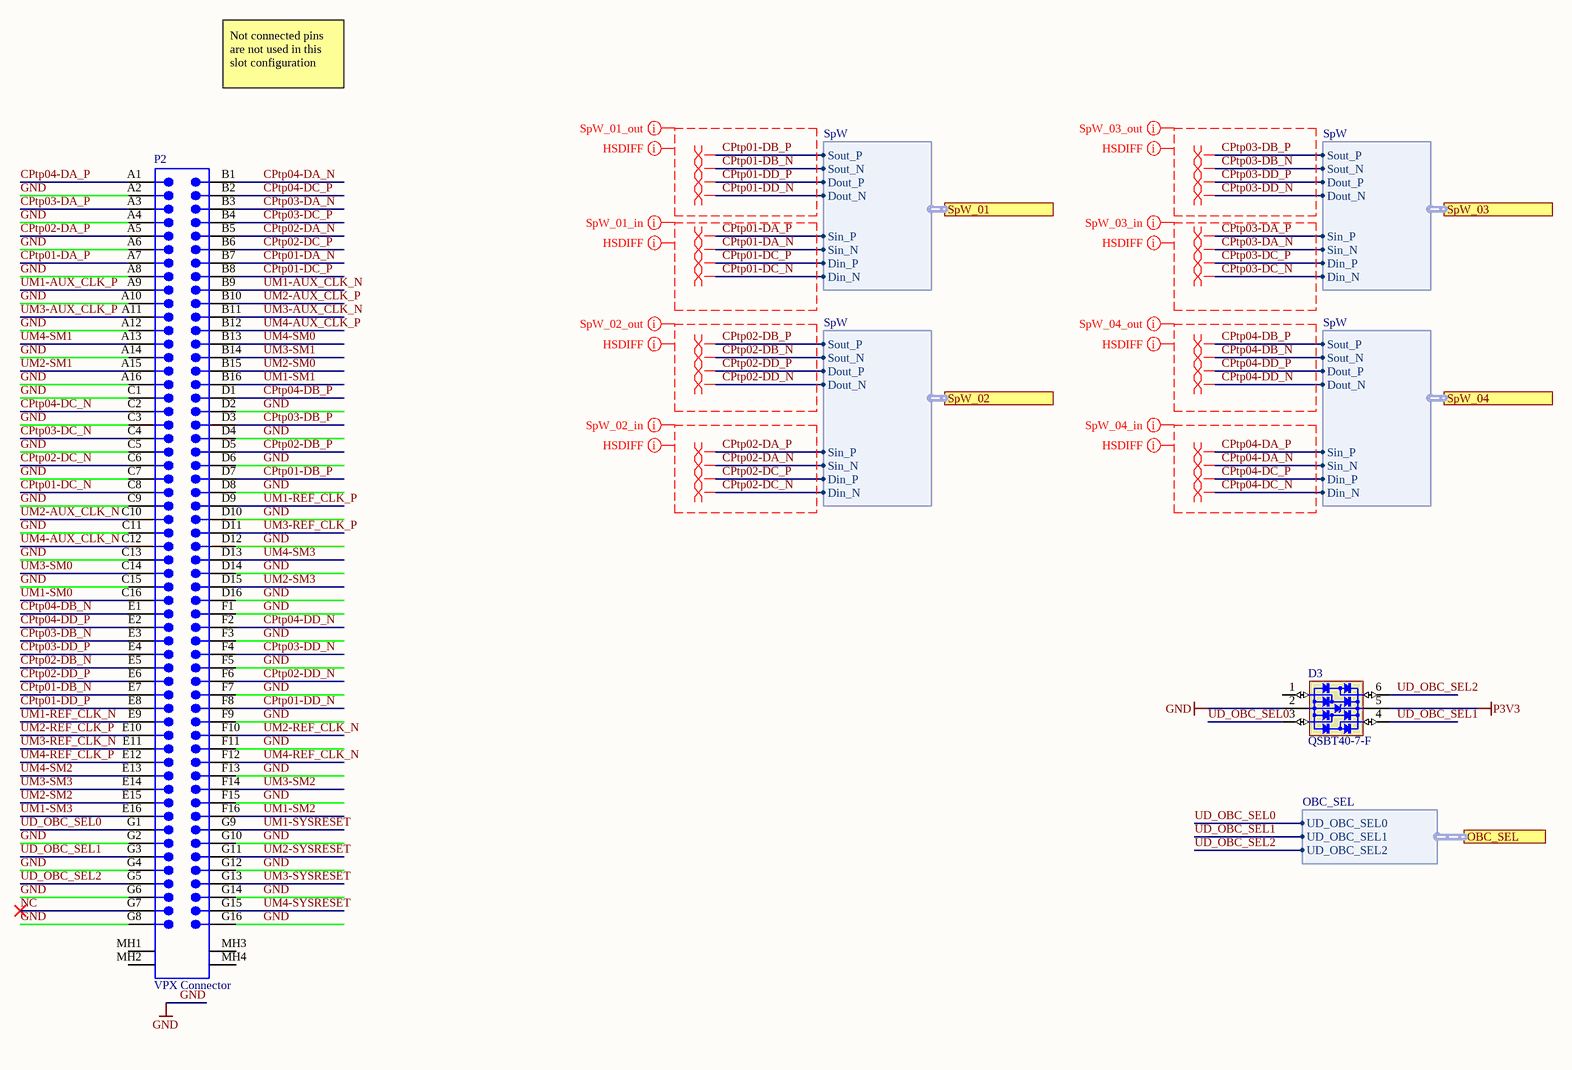
[diagram p3: SLT3-PAY-1Q2T_P2.SchDoc]

### Parts
D3  QSBT40-7-F  [SOT65P210X110-6N]
P2  VPX Connector  [BTB1-8-4H112M]

### Ports
OBC_SEL (harness OBC_SEL), SpW_01 (harness SpW), SpW_02 (harness SpW), SpW_03 (harness SpW), SpW_04 (harness SpW)

### Harnesses
SpW: Sout_P, Sout_N, Dout_P, Dout_N, Sin_P, Sin_N, Din_P, Din_N
OBC_SEL: UD_OBC_SEL0, UD_OBC_SEL1, UD_OBC_SEL2

### Nets
GND: D3.2(GND) P2.A2 P2.A4 P2.A6 P2.A8 P2.A10 P2.A12 P2.A14 P2.A16 P2.C1 P2.C3 P2.C5 P2.C7 P2.C9 P2.C11 P2.C13 P2.C15 P2.D2 P2.D4 P2.D6 P2.D8 P2.D10 P2.D12 P2.D14 P2.D16 P2.F1 P2.F3 P2.F5 P2.F7 P2.F9 P2.F11 P2.F13 P2.F15 P2.G2 P2.G4 P2.G6 P2.G8 P2.G10 P2.G12 P2.G14 P2.G16
P3V3: D3.5(VBUS)  [project net 3.3V]
CPtp01-DA_N: P2.B7 ; port SpW_01.Sin_N
CPtp01-DA_P: P2.A7 ; port SpW_01.Sin_P
CPtp01-DB_N: P2.E7 ; port SpW_01.Sout_N
CPtp01-DB_P: P2.D7 ; port SpW_01.Sout_P
CPtp01-DC_N: P2.C8 ; port SpW_01.Din_N
CPtp01-DC_P: P2.B8 ; port SpW_01.Din_P
CPtp01-DD_N: P2.F8 ; port SpW_01.Dout_N
CPtp01-DD_P: P2.E8 ; port SpW_01.Dout_P
CPtp02-DA_N: P2.B5 ; port SpW_02.Sin_N
CPtp02-DA_P: P2.A5 ; port SpW_02.Sin_P
CPtp02-DB_N: P2.E5 ; port SpW_02.Sout_N
CPtp02-DB_P: P2.D5 ; port SpW_02.Sout_P
CPtp02-DC_N: P2.C6 ; port SpW_02.Din_N
CPtp02-DC_P: P2.B6 ; port SpW_02.Din_P
CPtp02-DD_N: P2.F6 ; port SpW_02.Dout_N
CPtp02-DD_P: P2.E6 ; port SpW_02.Dout_P
CPtp03-DA_N: P2.B3 ; port SpW_03.Sin_N
CPtp03-DA_P: P2.A3 ; port SpW_03.Sin_P
CPtp03-DB_N: P2.E3 ; port SpW_03.Sout_N
CPtp03-DB_P: P2.D3 ; port SpW_03.Sout_P
CPtp03-DC_N: P2.C4 ; port SpW_03.Din_N
CPtp03-DC_P: P2.B4 ; port SpW_03.Din_P
CPtp03-DD_N: P2.F4 ; port SpW_03.Dout_N
CPtp03-DD_P: P2.E4 ; port SpW_03.Dout_P
CPtp04-DA_N: P2.B1 ; port SpW_04.Sin_N
CPtp04-DA_P: P2.A1 ; port SpW_04.Sin_P
CPtp04-DB_N: P2.E1 ; port SpW_04.Sout_N
CPtp04-DB_P: P2.D1 ; port SpW_04.Sout_P
CPtp04-DC_N: P2.C2 ; port SpW_04.Din_N
CPtp04-DC_P: P2.B2 ; port SpW_04.Din_P
CPtp04-DD_N: P2.F2 ; port SpW_04.Dout_N
CPtp04-DD_P: P2.E2 ; port SpW_04.Dout_P
NC: P2.G7  [project net NC_12]
UD_OBC_SEL0: D3.3(I/O2) P2.G1 ; port OBC_SEL.UD_OBC_SEL0
UD_OBC_SEL1: D3.4(I/O3) P2.G3 ; port OBC_SEL.UD_OBC_SEL1
UD_OBC_SEL2: D3.6(I/O4) P2.G5 ; port OBC_SEL.UD_OBC_SEL2
UM1-AUX_CLK_N: P2.B9  [project net UM1-AUX_CLK_N_12]
UM1-AUX_CLK_P: P2.A9  [project net UM1-AUX_CLK_P_12]
UM1-REF_CLK_N: P2.E9  [project net UM1-REF_CLK_N_12]
UM1-REF_CLK_P: P2.D9  [project net UM1-REF_CLK_P_12]
UM1-SM0: P2.C16  [project net UM1-SM0_12]
UM1-SM1: P2.B16  [project net UM1-SM1_12]
UM1-SM2: P2.F16  [project net UM1-SM2_12]
UM1-SM3: P2.E16  [project net UM1-SM3_12]
UM1-SYSRESET: P2.G9  [project net UM1-SYSRESET_12]
UM2-AUX_CLK_N: P2.C10  [project net UM2-AUX_CLK_N_12]
UM2-AUX_CLK_P: P2.B10  [project net UM2-AUX_CLK_P_12]
UM2-REF_CLK_N: P2.F10  [project net UM2-REF_CLK_N_12]
UM2-REF_CLK_P: P2.E10  [project net UM2-REF_CLK_P_12]
UM2-SM0: P2.B15  [project net UM2-SM0_12]
UM2-SM1: P2.A15  [project net UM2-SM1_12]
UM2-SM2: P2.E15  [project net UM2-SM2_12]
UM2-SM3: P2.D15  [project net UM2-SM3_12]
UM2-SYSRESET: P2.G11  [project net UM2-SYSRESET_12]
UM3-AUX_CLK_N: P2.B11  [project net UM3-AUX_CLK_N_12]
UM3-AUX_CLK_P: P2.A11  [project net UM3-AUX_CLK_P_12]
UM3-REF_CLK_N: P2.E11  [project net UM3-REF_CLK_N_12]
UM3-REF_CLK_P: P2.D11  [project net UM3-REF_CLK_P_12]
UM3-SM0: P2.C14  [project net UM3-SM0_12]
UM3-SM1: P2.B14  [project net UM3-SM1_12]
UM3-SM2: P2.F14  [project net UM3-SM2_12]
UM3-SM3: P2.E14  [project net UM3-SM3_12]
UM3-SYSRESET: P2.G13  [project net UM3-SYSRESET_12]
UM4-AUX_CLK_N: P2.C12  [project net UM4-AUX_CLK_N_12]
UM4-AUX_CLK_P: P2.B12  [project net UM4-AUX_CLK_P_12]
UM4-REF_CLK_N: P2.F12  [project net UM4-REF_CLK_N_12]
UM4-REF_CLK_P: P2.E12  [project net UM4-REF_CLK_P_12]
UM4-SM0: P2.B13  [project net UM4-SM0_12]
UM4-SM1: P2.A13  [project net UM4-SM1_12]
UM4-SM2: P2.E13  [project net UM4-SM2_12]
UM4-SM3: P2.D13  [project net UM4-SM3_12]
UM4-SYSRESET: P2.G15  [project net UM4-SYSRESET_12]

Not connected (* = marked no-connect by the designer): D3 1(I/O1); P2 MH1 MH2 MH3 MH4

### Layout directives
differential pair: CPtp01-DA_N, CPtp01-DA_P, CPtp01-DB_N, CPtp01-DB_P, CPtp01-DC_N, CPtp01-DC_P, CPtp01-DD_N, CPtp01-DD_P, CPtp02-DA_N, CPtp02-DA_P, CPtp02-DB_N, CPtp02-DB_P, CPtp02-DC_N, CPtp02-DC_P, CPtp02-DD_N, CPtp02-DD_P, CPtp03-DA_N, CPtp03-DA_P, CPtp03-DB_N, CPtp03-DB_P, CPtp03-DC_N, CPtp03-DC_P, CPtp03-DD_N, CPtp03-DD_P, CPtp04-DA_N, CPtp04-DA_P, CPtp04-DB_N, CPtp04-DB_P, CPtp04-DC_N, CPtp04-DC_P, CPtp04-DD_N, CPtp04-DD_P
net class SpW_01_out: CPtp01-DB_N, CPtp01-DB_P, CPtp01-DD_N, CPtp01-DD_P
net class SpW_01_in: CPtp01-DA_N, CPtp01-DA_P, CPtp01-DC_N, CPtp01-DC_P
net class SpW_02_out: CPtp02-DB_N, CPtp02-DB_P, CPtp02-DD_N, CPtp02-DD_P
net class SpW_02_in: CPtp02-DA_N, CPtp02-DA_P, CPtp02-DC_N, CPtp02-DC_P
net class HSDIFF: CPtp01-DA_N, CPtp01-DA_P, CPtp01-DB_N, CPtp01-DB_P, CPtp01-DC_N, CPtp01-DC_P, CPtp01-DD_N, CPtp01-DD_P, CPtp02-DA_N, CPtp02-DA_P, CPtp02-DB_N, CPtp02-DB_P, CPtp02-DC_N, CPtp02-DC_P, CPtp02-DD_N, CPtp02-DD_P, CPtp03-DA_N, CPtp03-DA_P, CPtp03-DB_N, CPtp03-DB_P, CPtp03-DC_N, CPtp03-DC_P, CPtp03-DD_N, CPtp03-DD_P, CPtp04-DA_N, CPtp04-DA_P, CPtp04-DB_N, CPtp04-DB_P, CPtp04-DC_N, CPtp04-DC_P, CPtp04-DD_N, CPtp04-DD_P
net class SpW_03_out: CPtp03-DB_N, CPtp03-DB_P, CPtp03-DD_N, CPtp03-DD_P
net class SpW_03_in: CPtp03-DA_N, CPtp03-DA_P, CPtp03-DC_N, CPtp03-DC_P
net class SpW_04_out: CPtp04-DB_N, CPtp04-DB_P, CPtp04-DD_N, CPtp04-DD_P
net class SpW_04_in: CPtp04-DA_N, CPtp04-DA_P, CPtp04-DC_N, CPtp04-DC_P

### Notes on the sheet
- Not connected pins are not used in this slot configuration
- Title
- Size:
- Date:
- A3
- Number:
- Time:
- Revision:
- Sheet
- of
- File:

### Library data of the parts
D3 = D_TVS_QSBT40-7-F: Bonding: No; PressFit: No; Case: *; Component Kind: Standard; Component Type: Standard; ComponentHeigth: *; CreateDate: 2018-01-01; Device: QSBT40-7-F; Footprint: SOT363; HelpURL: *; LatestRevisionDate: 2018-01-01; Manufacturer: *; Manufacturer Part Number: QSBT40-7-F; Mounted: Yes; PackageDescription: *; Part Description: *; Part Number: *; Pin Count: 6; Sense: No; SMD: Yes; Socket: No; Value: *
P2 = 2102771-1: as P1 on sheet SLT3-PAY-1Q2T_P1; Case: *; Component Kind: Standard; Component Type: Standard; CreateDate: 2018-01-01; Device: *; Footprint: *; HelpURL: *; LatestRevisionDate: 2018-01-01; Manufacturer Part Number: 2102771-1; Mounted: Yes; PackageDescription: 2102771-1; Part Description: Ruggedized Board-to-Board Connector, Right Angle, 7-Row, Pitch 1.8mm, 112-Position; Part Number: 2102771-1; Pin Count: *; Sense: No; SMD: Yes; Socket: No; Family: VPX Connector

## Sheet SVPX_protection.SchDoc: SpaceVPX interface protection
size A4; Organization: Creotech Instruments; Address1: Gen. L. Okulickiego 7/9; Address2: 05-500 Piaseczno; Address3: Poland
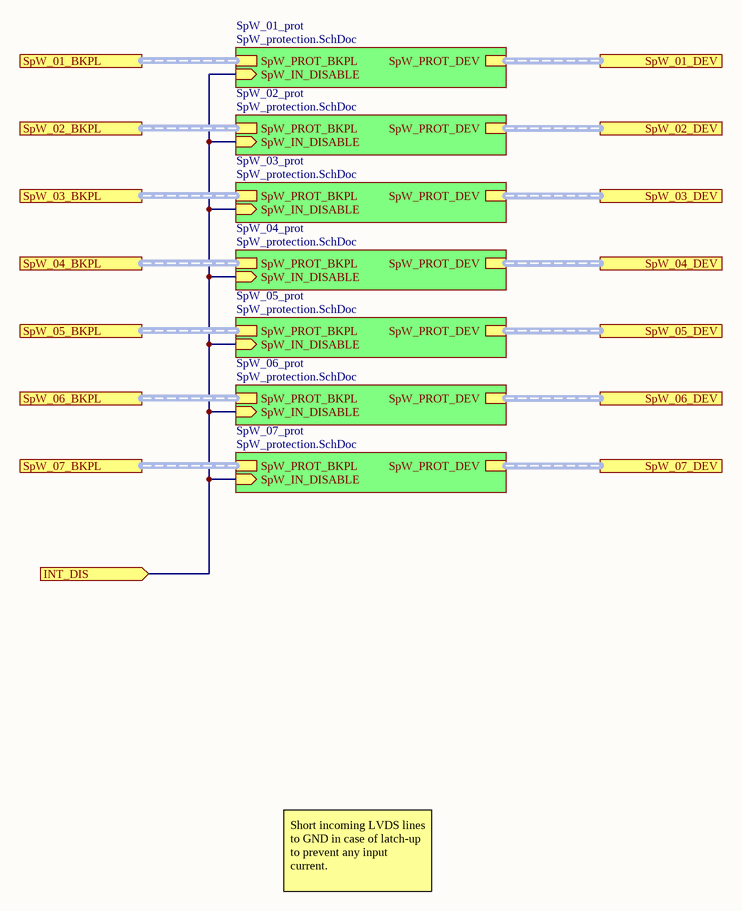
[diagram p4: SVPX_protection.SchDoc]

### Sub-sheets
SpW_01_prot = SpW_protection.SchDoc: SpW_PROT_BKPL (harness SpW), SpW_PROT_DEV (harness SpW), SpW_IN_DISABLE (in)
SpW_02_prot = SpW_protection.SchDoc: SpW_PROT_BKPL (harness SpW), SpW_PROT_DEV (harness SpW), SpW_IN_DISABLE (in)
SpW_03_prot = SpW_protection.SchDoc: SpW_PROT_BKPL (harness SpW), SpW_PROT_DEV (harness SpW), SpW_IN_DISABLE (in)
SpW_04_prot = SpW_protection.SchDoc: SpW_PROT_BKPL (harness SpW), SpW_PROT_DEV (harness SpW), SpW_IN_DISABLE (in)
SpW_05_prot = SpW_protection.SchDoc: SpW_PROT_BKPL (harness SpW), SpW_PROT_DEV (harness SpW), SpW_IN_DISABLE (in)
SpW_06_prot = SpW_protection.SchDoc: SpW_PROT_BKPL (harness SpW), SpW_PROT_DEV (harness SpW), SpW_IN_DISABLE (in)
SpW_07_prot = SpW_protection.SchDoc: SpW_PROT_BKPL (harness SpW), SpW_PROT_DEV (harness SpW), SpW_IN_DISABLE (in)

### Ports
INT_DIS (in), SpW_01_BKPL (harness SpW), SpW_01_DEV (harness SpW), SpW_02_BKPL (harness SpW), SpW_02_DEV (harness SpW), SpW_03_BKPL (harness SpW), SpW_03_DEV (harness SpW), SpW_04_BKPL (harness SpW), SpW_04_DEV (harness SpW), SpW_05_BKPL (harness SpW), SpW_05_DEV (harness SpW), SpW_06_BKPL (harness SpW), SpW_06_DEV (harness SpW), SpW_07_BKPL (harness SpW), SpW_07_DEV (harness SpW)

### Nets
DIS_LVDS: port INT_DIS, sheet SpW_01_prot/SpW_IN_DISABLE, sheet SpW_02_prot/SpW_IN_DISABLE, sheet SpW_03_prot/SpW_IN_DISABLE, sheet SpW_04_prot/SpW_IN_DISABLE, sheet SpW_05_prot/SpW_IN_DISABLE, sheet SpW_06_prot/SpW_IN_DISABLE, sheet SpW_07_prot/SpW_IN_DISABLE

### Buses and harness runs
harness port SpW_01_BKPL = sheet SpW_01_prot/SpW_PROT_BKPL
harness port SpW_01_DEV = sheet SpW_01_prot/SpW_PROT_DEV
harness port SpW_02_BKPL = sheet SpW_02_prot/SpW_PROT_BKPL
harness port SpW_02_DEV = sheet SpW_02_prot/SpW_PROT_DEV
harness port SpW_03_BKPL = sheet SpW_03_prot/SpW_PROT_BKPL
harness port SpW_03_DEV = sheet SpW_03_prot/SpW_PROT_DEV
harness port SpW_04_BKPL = sheet SpW_04_prot/SpW_PROT_BKPL
harness port SpW_04_DEV = sheet SpW_04_prot/SpW_PROT_DEV
harness port SpW_05_BKPL = sheet SpW_05_prot/SpW_PROT_BKPL
harness port SpW_05_DEV = sheet SpW_05_prot/SpW_PROT_DEV
harness port SpW_06_BKPL = sheet SpW_06_prot/SpW_PROT_BKPL
harness port SpW_06_DEV = sheet SpW_06_prot/SpW_PROT_DEV
harness port SpW_07_BKPL = sheet SpW_07_prot/SpW_PROT_BKPL
harness port SpW_07_DEV = sheet SpW_07_prot/SpW_PROT_DEV

### Notes on the sheet
- Short incoming LVDS lines to GND in case of latch-up to prevent any input current.
- Title
- Size:
- Date:
- A4
- Number:
- Time:
- Revision:
- Sheet
- of
- File:

## Sheet SpW_protection.SchDoc: SpaceWire protection
size A4; Organization: Creotech Instruments; Address1: Gen. L. Okulickiego 7/9; Address2: 05-500 Piaseczno; Address3: Poland
Used 7 times, as channels U_SVPX_protection/SpW_01_prot, U_SVPX_protection/SpW_02_prot, U_SVPX_protection/SpW_03_prot, U_SVPX_protection/SpW_04_prot, U_SVPX_protection/SpW_05_prot, U_SVPX_protection/SpW_06_prot, U_SVPX_protection/SpW_07_prot. Parts and nets are listed once, with the designators drawn on the sheet.
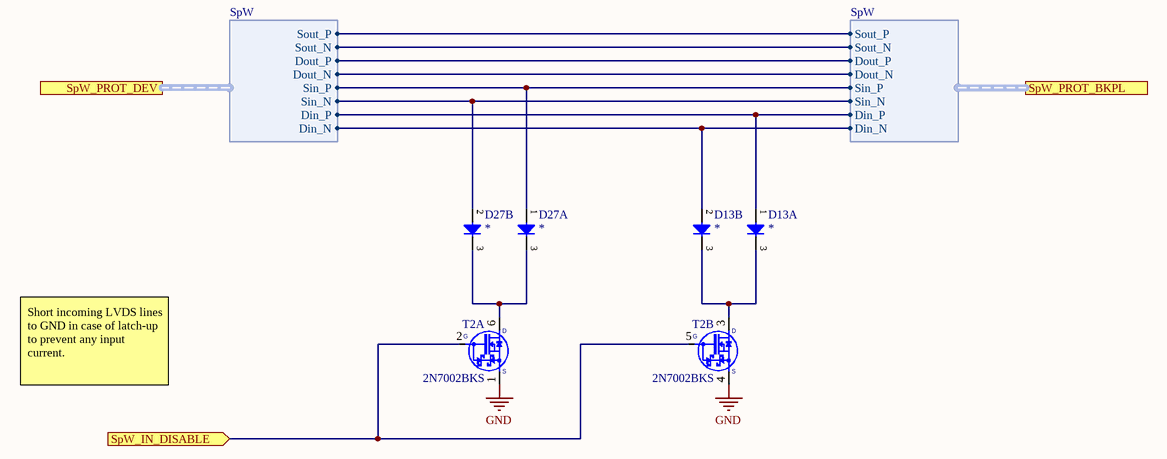
[diagram p5: SpW_protection.SchDoc]

### Parts
D13  *  [SOT65P210X110-3N]  (parts A,B of 2)
D27  *  [SOT65P210X110-3N]  (parts A,B of 2)
T2  2N7002BKS  [SOT65P210X110-6N]  (parts A,B of 2)

### Ports
SpW_IN_DISABLE (in), SpW_PROT_BKPL (harness SpW), SpW_PROT_DEV (harness SpW)

### Harnesses
SpW: Sout_P, Sout_N, Dout_P, Dout_N, Sin_P, Sin_N, Din_P, Din_N

### Nets
GND: T2.1(S) T2.4(S)
SpW_IN_DISABLE: T2.2(G) T2.5(G) ; port SpW_IN_DISABLE
NetD13_1: D13.1(A) ; port SpW_PROT_BKPL.Din_P, port SpW_PROT_DEV.Din_P
NetD13_2: D13.2(A) ; port SpW_PROT_BKPL.Din_N, port SpW_PROT_DEV.Din_N
NetD13_3: D13.3(COMC) T2.3(D)
NetD27_1: D27.1(A) ; port SpW_PROT_BKPL.Sin_P, port SpW_PROT_DEV.Sin_P
NetD27_2: D27.2(A) ; port SpW_PROT_BKPL.Sin_N, port SpW_PROT_DEV.Sin_N
NetD27_3: D27.3(COMC) T2.6(D)
(unnamed): port SpW_PROT_BKPL.Sout_P, port SpW_PROT_DEV.Sout_P
(unnamed): port SpW_PROT_BKPL.Sout_N, port SpW_PROT_DEV.Sout_N
(unnamed): port SpW_PROT_BKPL.Dout_P, port SpW_PROT_DEV.Dout_P
(unnamed): port SpW_PROT_BKPL.Dout_N, port SpW_PROT_DEV.Dout_N

### Channels
U_SVPX_protection/SpW_01_prot: designators end in A; ports SpW_IN_DISABLE=DIS_LVDS
U_SVPX_protection/SpW_02_prot: designators end in B; ports SpW_IN_DISABLE=DIS_LVDS
U_SVPX_protection/SpW_03_prot: designators end in C; ports SpW_IN_DISABLE=DIS_LVDS
U_SVPX_protection/SpW_04_prot: designators end in D; ports SpW_IN_DISABLE=DIS_LVDS
U_SVPX_protection/SpW_05_prot: designators end in E; ports SpW_IN_DISABLE=DIS_LVDS
U_SVPX_protection/SpW_06_prot: designators end in F; ports SpW_IN_DISABLE=DIS_LVDS
U_SVPX_protection/SpW_07_prot: designators end in G; ports SpW_IN_DISABLE=DIS_LVDS

### Notes on the sheet
- Short incoming LVDS lines to GND in case of latch-up to prevent any input current.
- Title
- Size:
- Date:
- A4
- Number:
- Time:
- Revision:
- Sheet
- of
- File:

### Library data of the parts
D13 D27 = BAT1705WH: Manufacturer Part Number: BAT1705WH6327; Bonding: No; PressFit: No; Case: *; Component Kind: Standard; Component Type: Standard; ComponentHeigth: *; CreateDate: 2018-01-01; Device: *; Footprint: *; HelpURL: *; LatestRevisionDate: 2018-01-01; Manufacturer: *; Mounted: Yes; PackageDescription: *; Part Description: *; Part Number: BAT1705WH6327; Pin Count: *; Sense: No; SMD: Yes; Socket: No; Value: *
T2 = 2N7002BKS: 60V, 300mA Dual N-Channel Trench MOSFET; Manufacturer: NXP SEMICONDUCTORS; Manufacturer Part Number: 2N7002BKS6; PressFit: No; Bonding: No; Part Number: 2N7002BKS; Component Kind: Standard; Component Type: Standard; Device: 2N7002BKS; PackageDescription: SOT363, SC70-6, SOT, 0.65mm Pitch, 6 pin, 1.25mm W X 2.00mm L X 1.10mm H, IPC Medium Density; Part Description: 60 V, 300 mA Dual N-Channel Trench MOSFET; Pin Count: 4; Case: SOT363; Mounted: Yes; Socket: No; SMD: Yes; Sense: No; ComponentHeight: 1.1mm; HelpURL: \\cern.ch\dfs\Applications\Altium\Datasheets\2N7002BKS.pdf; Author: CERN DEM JLC; CreateDate: 2012-11-27; LatestRevisionDate: 2012-11-27

## Sheet GR740.SchDoc
size A4
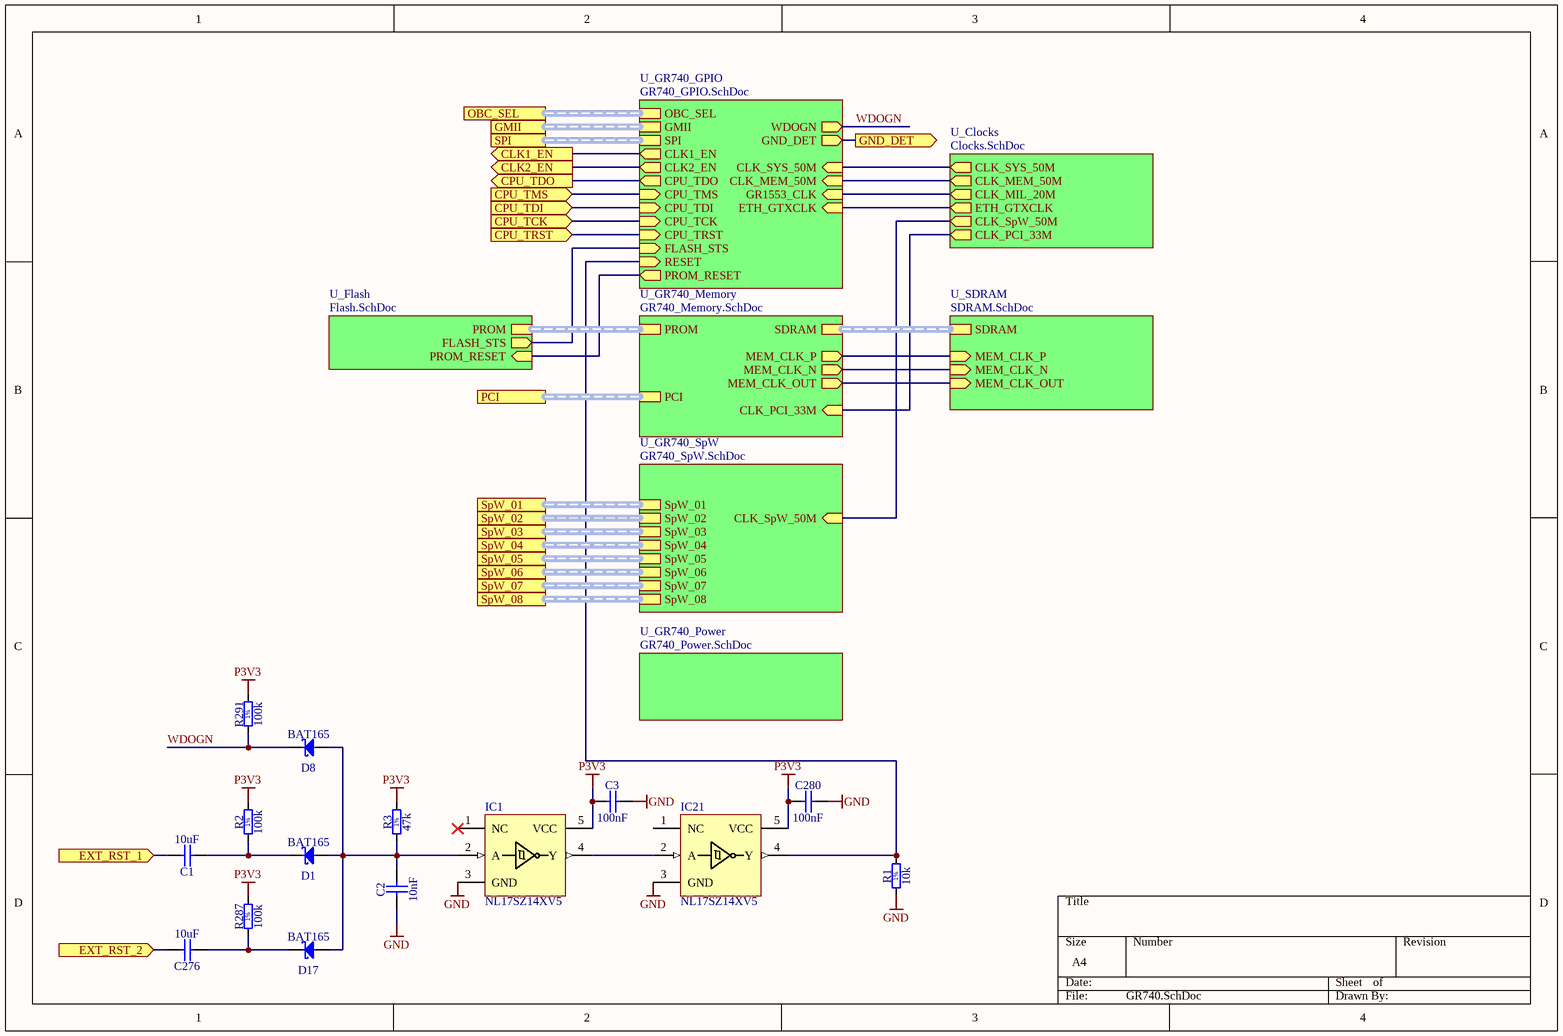
[diagram p6: GR740.SchDoc]

### Parts
C1  10uF  [CAPC1608X80N]
C2  10nF  [CAPC1005X55N]
C3  100nF  [CAPC1005X55N]
C276  10uF  [CAPC1608X80N]
C280  100nF  [CAPC1005X55N]
D1  BAT165  [SOD2512X110N]
D8  BAT165  [SOD2512X110N]
D17  BAT165  [SOD2512X110N]
IC1  NL17SZ14XV5  [SOT50P160X60-5N]
IC21  NL17SZ14XV5  [SOT50P160X60-5N]
R1  10k  [RESC1005X40N]
R2  100k  [RESC1005X40N]
R3  47k  [RESC1005X40N]
R287  100k  [RESC1005X40N]
R291  100k  [RESC1005X40N]

### Sub-sheets
U_Clocks = Clocks.SchDoc: CLK_SpW_50M (out), CLK_SYS_50M (out), CLK_MEM_50M (out), CLK_MIL_20M (out), CLK_PCI_33M (out), ETH_GTXCLK (out)
U_Flash = Flash.SchDoc: PROM (harness PROM), FLASH_STS (out), PROM_RESET (in)
U_GR740_GPIO = GR740_GPIO.SchDoc: CLK_SYS_50M (in), CLK_MEM_50M (in), RESET (in), GR1553_CLK (in), ETH_GTXCLK (in), SPI (harness SPI), GMII (harness GMII), CPU_TDO (out), CPU_TMS (in), CPU_TDI (in), CPU_TCK (in), CPU_TRST (in), OBC_SEL (harness OBC_SEL), CLK2_EN (out), CLK1_EN (out), WDOGN (out), FLASH_STS (in), PROM_RESET (out), GND_DET (out)
U_GR740_Memory = GR740_Memory.SchDoc: SDRAM (harness SDRAM), PCI (harness PCI), MEM_CLK_P (out), MEM_CLK_N (out), MEM_CLK_OUT (out), PROM (harness PROM), CLK_PCI_33M (in)
U_GR740_Power = GR740_Power.SchDoc: no entries
U_GR740_SpW = GR740_SpW.SchDoc: CLK_SpW_50M (in), SpW_03 (harness SpW), SpW_04 (harness SpW), SpW_01 (harness SpW), SpW_02 (harness SpW), SpW_07 (harness SpW), SpW_08 (harness SpW), SpW_05 (harness SpW), SpW_06 (harness SpW)
U_SDRAM = SDRAM.SchDoc: SDRAM (harness SDRAM), MEM_CLK_P (in), MEM_CLK_N (in), MEM_CLK_OUT (in)

### Ports
CLK1_EN (out), CLK2_EN (out), CPU_TCK (in), CPU_TDI (in), CPU_TDO (out), CPU_TMS (in), CPU_TRST (in), EXT_RST_1 (in), EXT_RST_2 (in), GMII (harness GMII), GND_DET (out), OBC_SEL (harness OBC_SEL), PCI (harness PCI), SPI (harness SPI), SpW_01 (harness SpW), SpW_02 (harness SpW), SpW_03 (harness SpW), SpW_04 (harness SpW), SpW_05 (harness SpW), SpW_06 (harness SpW), SpW_07 (harness SpW), SpW_08 (harness SpW)

### Nets
GND: C2.1 C3.2 C280.2 IC1.3(GND) IC21.3(GND) R1.1
P3V3: C3.1 C280.1 IC1.5(VCC) IC21.5(VCC) R2.2 R3.2 R287.2 R291.2  [project net 3.3V]
CLK1_EN: port CLK1_EN, sheet U_GR740_GPIO/CLK1_EN
CLK2_EN: port CLK2_EN, sheet U_GR740_GPIO/CLK2_EN
CLK_MEM_50M: sheet U_GR740_GPIO/CLK_MEM_50M, sheet U_Clocks/CLK_MEM_50M
CLK_MIL_20M: sheet U_GR740_GPIO/GR1553_CLK, sheet U_Clocks/CLK_MIL_20M
CLK_SpW_50M: sheet U_GR740_SpW/CLK_SpW_50M, sheet U_Clocks/CLK_SpW_50M
CLK_SYS_50M: sheet U_GR740_GPIO/CLK_SYS_50M, sheet U_Clocks/CLK_SYS_50M
CPU_RST: C1.2 ; port EXT_RST_1
CPU_TCK: port CPU_TCK, sheet U_GR740_GPIO/CPU_TCK
CPU_TDI: port CPU_TDI, sheet U_GR740_GPIO/CPU_TDI
CPU_TDO: port CPU_TDO, sheet U_GR740_GPIO/CPU_TDO
CPU_TMS: port CPU_TMS, sheet U_GR740_GPIO/CPU_TMS
CPU_TRST: port CPU_TRST, sheet U_GR740_GPIO/CPU_TRST
ETH_GTXCLK: sheet U_GR740_GPIO/ETH_GTXCLK, sheet U_Clocks/ETH_GTXCLK
FLASH_STS: sheet U_GR740_GPIO/FLASH_STS, sheet U_Flash/FLASH_STS
GND_DET: port GND_DET, sheet U_GR740_GPIO/GND_DET
MEM_CLK_N: sheet U_GR740_Memory/MEM_CLK_N, sheet U_SDRAM/MEM_CLK_N
MEM_CLK_OUT: sheet U_GR740_Memory/MEM_CLK_OUT, sheet U_SDRAM/MEM_CLK_OUT
MEM_CLK_P: sheet U_GR740_Memory/MEM_CLK_P, sheet U_SDRAM/MEM_CLK_P
PROM_RESET: sheet U_GR740_GPIO/PROM_RESET, sheet U_Flash/PROM_RESET
RESET: IC21.4(Y) R1.2 ; sheet U_GR740_GPIO/RESET
SYSRESET*: C276.2 ; port EXT_RST_2
WDOGN: D8.1(C) R291.1 ; sheet U_GR740_GPIO/WDOGN
X_CLK: sheet U_GR740_Memory/CLK_PCI_33M, sheet U_Clocks/CLK_PCI_33M
NetC1_1: C1.1 D1.1(C) R2.1
NetC2_2: C2.2 D1.2(A) D8.2(A) D17.2(A) IC1.2(A) R3.1
NetC276_1: C276.1 D17.1(C) R287.1
NetIC1_4: IC1.4(Y) IC21.2(A)

Not connected (* = marked no-connect by the designer): IC1 1(NC)*; IC21 1(NC)

### Buses and harness runs
harness port GMII = sheet U_GR740_GPIO/GMII
harness port OBC_SEL = sheet U_GR740_GPIO/OBC_SEL
harness port PCI = sheet U_GR740_Memory/PCI
harness port SPI = sheet U_GR740_GPIO/SPI
harness port SpW_01 = sheet U_GR740_SpW/SpW_01
harness port SpW_02 = sheet U_GR740_SpW/SpW_02
harness port SpW_03 = sheet U_GR740_SpW/SpW_03
harness port SpW_04 = sheet U_GR740_SpW/SpW_04
harness port SpW_05 = sheet U_GR740_SpW/SpW_05
harness port SpW_06 = sheet U_GR740_SpW/SpW_06
harness port SpW_07 = sheet U_GR740_SpW/SpW_07
harness port SpW_08 = sheet U_GR740_SpW/SpW_08
harness sheet U_Flash/PROM = sheet U_GR740_Memory/PROM
harness sheet U_GR740_Memory/SDRAM = sheet U_SDRAM/SDRAM

### Notes on the sheet
- (in symbol R0402_10K_1%_0.0625W_100PPM) 1%
- (in symbol R0402_47K_1%_0.0625W_100PPM) 1%
- (in symbol R0402_100K_1%_0.0625W_100PPM) 1%

### Library data of the parts
C1 C276 = CC0603_10UF_16V_20%_X5R: Non-polarised capacitor; Part Description: SMD Multilayer Chip Ceramic Capacitor; Manufacturer: GENERIC; Manufacturer1 Part Number: GRM188R61C106MA73D; Voltage: 16V; TC: X5R; Tolerance: ±20%; Part Number: CC0603_10UF_16V_20%_X5R; Component Kind: Standard; Component Type: Standard; Pin Count: 2; Value: 10uF; Status: None; Manufacturer Part Number: CC0603_10UF_16V_20%_X5R; Case: 0603; Mounted: Yes; Socket: No; SMD: Yes; Sense: No; Manufacturer1 Example: MURATA; Manufacturer1 ComponentHeight: 0.8mm; HelpURL: \\cern.ch\dfs\Applications\Altium\Datasheets\CC0603_X5R_MURATA_GRM.pdf; Author: CERN DEM MR; CreateDate: 2016-03-02; LatestRevisionDate: 2016-03-02
C2 = CC0402_10NF_50V_10%_X7R: Non-polarised capacitor; Part Description: SMD Multilayer Chip Ceramic Capacitor; Manufacturer: GENERIC; Manufacturer1 Part Number: GRM155R71H103KA88D; Voltage: 50V; TC: X7R; Tolerance: ±10%; Part Number: CC0402_10NF_50V_10%_X7R; Component Kind: Standard; Component Type: Standard; Pin Count: 2; Value: 10nF; Status: None; Manufacturer Part Number: CC0402_10NF_50V_10%_X7R; Case: 0402; Mounted: Yes; Socket: No; SMD: Yes; Sense: No; Manufacturer1 Example: MURATA; Manufacturer1 ComponentHeight: 0.55mm; HelpURL: \\cern.ch\dfs\Applications\Altium\Datasheets\CC0402_X7R_MURATA_GRM.pdf; Author: CERN DEM MR; CreateDate: 08.01.2016; LatestRevisionDate: 08.01.2016
C3 C280 = CC0402_100NF_25V_10%_X7R_YUDEN_TMK105B7104KVHF: Non-polarised capacitor; Part Description: SMD Multilayer Chip Ceramic Capacitor (High Dielectric Type) for Automotive / Industrial Applications; Manufacturer: TAIYO YUDEN; Voltage: 25V; TC: X7R; Tolerance: ±10%; Part Number: CC0402_100NF_25V_10%_X7R_YUDEN_TMK105B7104KVHF; Component Kind: Standard; Component Type: Standard; Pin Count: 2; Value: 100nF; Status: Not Recommended; Manufacturer Part Number: TMK105B7104KVHF; Case: 0402; Mounted: Yes; Socket: No; SMD: Yes; Sense: No; HelpURL: \\cern.ch\dfs\Applications\Altium\Datasheets\CC0402_TAIYO-YUDEN_TMK105B7104KVHF.pdf; Author: CERN DEM JLC; CreateDate: 10.05.2017; LatestRevisionDate: 10.05.2017; ComponentHeight: 0.55mm
D1 D8 D17 = BAT165: Schottky Diode; Part Description: Medium Power AF Schottky Diode; Manufacturer: INFINEON; Voltage: 40V; Power: 750mA; PressFit: No; Bonding: No; Part Number: BAT165; Component Kind: Standard; Component Type: Standard; Device: BAT165; PackageDescription: Small Outline Diode (SOD-323), 1.70mm W X 1.25mm L X 1.10mm H body,  IPC Medium Density; Manufacturer Part Number: BAT165; Pin Count: 2; Case: SOD323; Mounted: Yes; Socket: No; SMD: Yes; Sense: No; ComponentHeight: 1.1mm; HelpURL: \\cern.ch\dfs\Applications\Altium\Datasheets\BAT165.pdf; Author: CERN DEM JLC; CreateDate: 12.11.2014; LatestRevisionDate: 12.11.2014
IC1 IC21 = NL17SZ14XV5: Single inverter with schmitt trigger; Manufacturer: On Semiconductor; Bonding: No; ComponentHeigth: 0.55mm; PressFit: No; Case: SOT-553; Component Kind: Standard; Component Type: Standard; CreateDate: 2019-05-06; Device: NL17SZ14XV5; Footprint: SOT23-5; HelpURL: https://www.onsemi.com/pub/Collateral/NL17SZ14-D.PDF; LatestRevisionDate: 2018-01-01; Manufacturer Part Number: NL17SZ14XV5; Mounted: Yes; PackageDescription: Body 1.6x1.2mm, Pitch 0.5mm; Part Description: Single inverter with schmitt trigger; Part Number: NL17SZ14XV5; Pin Count: 5; Sense: No; SMD: Yes; Socket: No; Value: *
R1 = R0402_10K_1%_0.0625W_100PPM: Resistor - 1%; Part Description: General Purpose Thick Film Chip Resistor; Manufacturer: GENERIC; Manufacturer1 Part Number: 232270671003L; TC: ±100ppm/°C; PressFit: No; Part Number: R0402_10K_1%_0.0625W_100PPM; Component Kind: Standard; Component Type: Standard; Pin Count: 2; Value: 10k; Status: Not Recommended; Power: 0.0625W; Tolerance: ±1%; Manufacturer Part Number: R0402_10K_1%_0.0625W_100PPM; Case: 0402; Mounted: Yes; Sense: No; Socket: No; SMD: Yes; Manufacturer1 Example: YAGEO PHYCOMP; Manufacturer1 ComponentHeight: 0.4mm; HelpURL: \\cern.ch\dfs\Applications\Altium\Datasheets\R0402_Phycomp_RC0402.pdf; Author: CERN DEM JLC; CreateDate: 03.12.2007; LatestRevisionDate: 17.10.2012
R2 R287 R291 = R0402_100K_1%_0.0625W_100PPM: Resistor - 1%; Part Description: General Purpose Thick Film Chip Resistor; Manufacturer: GENERIC; Manufacturer1 Part Number: 232270671004L; TC: ±100ppm/°C; PressFit: No; Part Number: R0402_100K_1%_0.0625W_100PPM; Component Kind: Standard; Component Type: Standard; Pin Count: 2; Value: 100k; Status: Not Recommended; Power: 0.0625W; Tolerance: ±1%; Manufacturer Part Number: R0402_100K_1%_0.0625W_100PPM; Case: 0402; Mounted: Yes; Sense: No; Socket: No; SMD: Yes; Manufacturer1 Example: YAGEO PHYCOMP; Manufacturer1 ComponentHeight: 0.4mm; HelpURL: \\cern.ch\dfs\Applications\Altium\Datasheets\R0402_Phycomp_RC0402.pdf; Author: CERN DEM JLC; CreateDate: 03.12.2007; LatestRevisionDate: 17.10.2012
R3 = R0402_47K_1%_0.0625W_100PPM: Resistor - 1%; Part Description: General Purpose Thick Film Chip Resistor; Manufacturer: GENERIC; Manufacturer1 Part Number: 232270675103L; TC: ±100ppm/°C; PressFit: No; Part Number: R0402_47K_1%_0.0625W_100PPM; Component Kind: Standard; Component Type: Standard; Pin Count: 2; Value: 47k; Status: Not Recommended; Power: 0.0625W; Tolerance: ±1%; Manufacturer Part Number: R0402_47K_1%_0.0625W_100PPM; Case: 0402; Mounted: Yes; Sense: No; Socket: No; SMD: Yes; Manufacturer1 Example: YAGEO PHYCOMP; Manufacturer1 ComponentHeight: 0.4mm; HelpURL: \\cern.ch\dfs\Applications\Altium\Datasheets\R0402_Phycomp_RC0402.pdf; Author: CERN DEM JLC; CreateDate: 03.12.2007; LatestRevisionDate: 17.10.2012